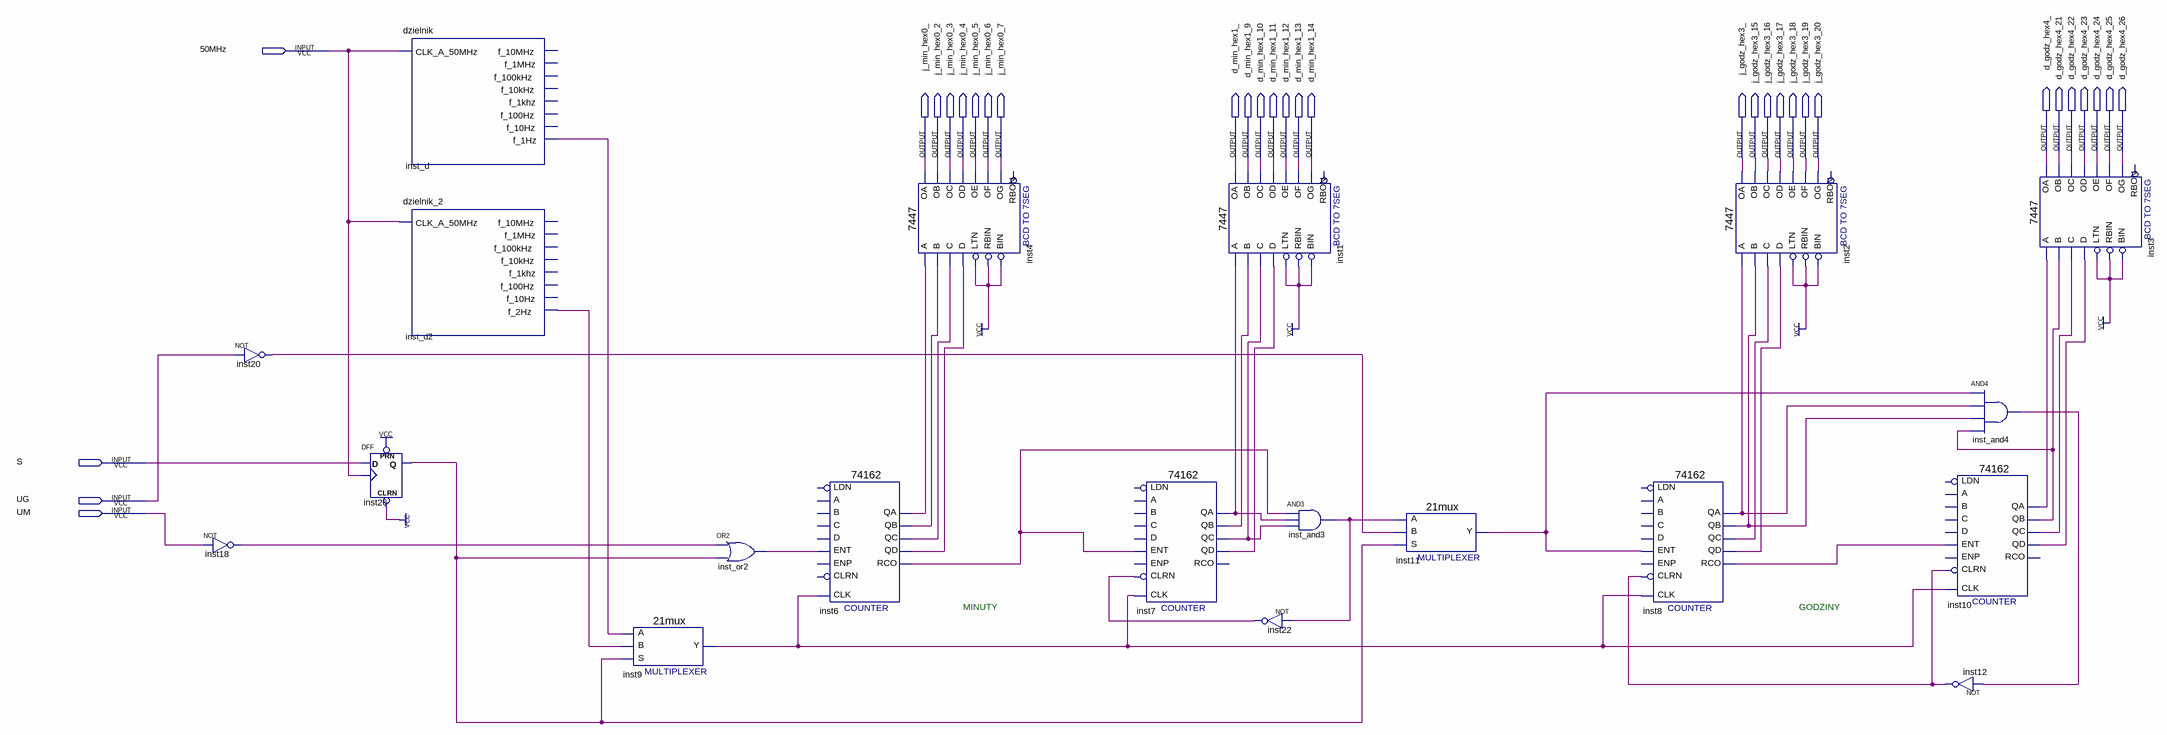
[diagram p0: schematic sheet]
// Quartus schematic zegar.bdf as structural Verilog: 20 symbols, 32 pins
module zegar (
  input  \50MHz ,
  input  S,
  input  UG,
  input  UM,
  output d_godz_hex4_,
  output d_godz_hex4_21,
  output d_godz_hex4_22,
  output d_godz_hex4_23,
  output d_godz_hex4_24,
  output d_godz_hex4_25,
  output d_godz_hex4_26,
  output j_min_hex0_,
  output j_min_hex0_2,
  output j_min_hex0_3,
  output j_min_hex0_4,
  output j_min_hex0_5,
  output j_min_hex0_6,
  output j_min_hex0_7,
  output d_min_hex1_,
  output d_min_hex1_9,
  output d_min_hex1_10,
  output d_min_hex1_11,
  output d_min_hex1_12,
  output d_min_hex1_13,
  output d_min_hex1_14,
  output j_godz_hex3_,
  output j_godz_hex3_15,
  output j_godz_hex3_16,
  output j_godz_hex3_17,
  output j_godz_hex3_18,
  output j_godz_hex3_19,
  output j_godz_hex3_20
);

  wire inst6_qa, inst6_qb, inst6_qc, inst6_qd, inst6_rco, inst7_qa, inst7_qb, inst7_qc, inst7_qd, inst8_qa,
       inst8_qb, inst8_qc, inst8_qd, inst8_rco, inst9_y, inst10_qa, inst10_qb, inst10_qc, inst10_qd,
       inst11_y, inst12_out, inst18_out, inst20_out, inst22_out, inst26_q, inst_and3_out, inst_and4_out,
       inst_d2_f_2hz, inst_d_f_1hz, inst_or2_out;

  not inst18 (inst18_out, UM);
  not inst20 (inst20_out, UG);
  dzielnik inst_d (
    .CLK_A_50MHz(\50MHz ), .f_1Hz(inst_d_f_1hz));  // open: f_10MHz, f_1MHz, f_100kHz, f_10kHz, f_1khz, f_100Hz, f_10Hz
  dzielnik_2 inst_d2 (
    .CLK_A_50MHz(\50MHz ), .f_2Hz(inst_d2_f_2hz));  // open: f_10MHz, f_1MHz, f_100kHz, f_10kHz, f_1khz, f_100Hz, f_10Hz
  DFF inst26 (.CLRN(1'b1), .CLK(\50MHz ), .D(S), .PRN(1'b1), .Q(inst26_q));
  \21mux  inst9 (.S(inst26_q), .B(inst_d2_f_2hz), .A(inst_d_f_1hz), .Y(inst9_y));
  or inst_or2 (inst_or2_out, inst18_out, inst26_q);
  \74162  inst6 (
    .ENT(inst_or2_out), .CLK(inst9_y), .QA(inst6_qa), .QB(inst6_qb), .QC(inst6_qc), .QD(inst6_qd),
    .RCO(inst6_rco));  // open: A, LDN, B, C, D, ENP, CLRN
  \7447  inst4 (
    .LTN(1'b1), .B(inst6_qb), .C(inst6_qc), .D(inst6_qd), .RBIN(1'b1), .BIN(1'b1), .A(inst6_qa),
    .OB(j_min_hex0_2), .OC(j_min_hex0_3), .OE(j_min_hex0_5), .OD(j_min_hex0_4), .OF(j_min_hex0_6),
    .OG(j_min_hex0_7), .OA(j_min_hex0_));  // open: RBON
  \74162  inst7 (
    .ENT(inst6_rco), .CLRN(inst22_out), .CLK(inst9_y), .QA(inst7_qa), .QB(inst7_qb), .QC(inst7_qc),
    .QD(inst7_qd));  // open: A, LDN, B, C, D, ENP, RCO
  \7447  inst1 (
    .LTN(1'b1), .B(inst7_qb), .C(inst7_qc), .D(inst7_qd), .RBIN(1'b1), .BIN(1'b1), .A(inst7_qa),
    .OB(d_min_hex1_9), .OC(d_min_hex1_10), .OE(d_min_hex1_12), .OD(d_min_hex1_11), .OF(d_min_hex1_13),
    .OG(d_min_hex1_14), .OA(d_min_hex1_));  // open: RBON
  not inst22 (inst22_out, inst_and3_out);
  and inst_and3 (inst_and3_out, inst6_rco, inst7_qa, inst7_qc);
  \21mux  inst11 (.S(inst26_q), .B(inst20_out), .A(inst_and3_out), .Y(inst11_y));
  \74162  inst8 (
    .ENT(inst11_y), .CLRN(inst12_out), .CLK(inst9_y), .QA(inst8_qa), .QB(inst8_qb), .QC(inst8_qc),
    .QD(inst8_qd), .RCO(inst8_rco));  // open: A, LDN, B, C, D, ENP
  \7447  inst2 (
    .LTN(1'b1), .B(inst8_qb), .C(inst8_qc), .D(inst8_qd), .RBIN(1'b1), .BIN(1'b1), .A(inst8_qa),
    .OB(j_godz_hex3_15), .OC(j_godz_hex3_16), .OE(j_godz_hex3_18), .OD(j_godz_hex3_17), .OF(j_godz_hex3_19),
    .OG(j_godz_hex3_20), .OA(j_godz_hex3_));  // open: RBON
  and inst_and4 (inst_and4_out, inst11_y, inst8_qa, inst8_qb, inst10_qb);
  \74162  inst10 (
    .ENT(inst8_rco), .CLRN(inst12_out), .CLK(inst9_y), .QA(inst10_qa), .QB(inst10_qb), .QC(inst10_qc),
    .QD(inst10_qd));  // open: A, LDN, B, C, D, ENP, RCO
  not inst12 (inst12_out, inst_and4_out);
  \7447  inst3 (
    .LTN(1'b1), .B(inst10_qb), .C(inst10_qc), .D(inst10_qd), .RBIN(1'b1), .BIN(1'b1), .A(inst10_qa),
    .OB(d_godz_hex4_21), .OC(d_godz_hex4_22), .OE(d_godz_hex4_24), .OD(d_godz_hex4_23), .OF(d_godz_hex4_25),
    .OG(d_godz_hex4_26), .OA(d_godz_hex4_));  // open: RBON

  // Notes on the sheet:
  //   MINUTY
  //   GODZINY
endmodule
